# EAGLE schematic LTC6241CS8PBF_breakout (EAGLE 8.5.1)
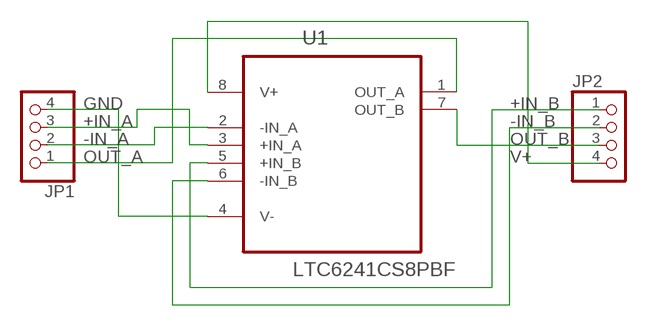
[diagram p0: schematic, sheet 1]

## Parts
JP1  PINHD-1X4  [1X04]
JP2  PINHD-1X4  [1X04]
U1  LTC6241CS8PBF  [SOIC127P600X175-8N]

## Nets
+IN_A: JP1.3 U1.3(+IN_A)
+IN_B: JP2.1 U1.5(+IN_B)
-IN_A: JP1.2 U1.2(-IN_A)
-IN_B: JP2.2 U1.6(-IN_B)
GND: JP1.4 U1.4(V-)
OUT_A: JP1.1 U1.1(OUT_A)
OUT_B: JP2.3 U1.7(OUT_B)
V+: JP2.4 U1.8(V+)

## Library data of the parts
JP1 JP2 = pinhead:PINHD-1X4: PIN HEADER
U1 = LTC6241CS8PBF:LTC6241CS8PBF: Low Noise, Rail-to-Rail Output,CMOS Op Amps; AVAILABILITY: Good; DESCRIPTION: LTC6241 - Dual 18MHz, Low Noise, Rail-to-Rail Output, CMOS Op Amp; MF: Linear Technology; MP: LTC6241CS8#PBF; PACKAGE: SO-8 Linear Technology; PRICE: 2.03 USD